# EAGLE design cartridge (EAGLE 7.1.0)
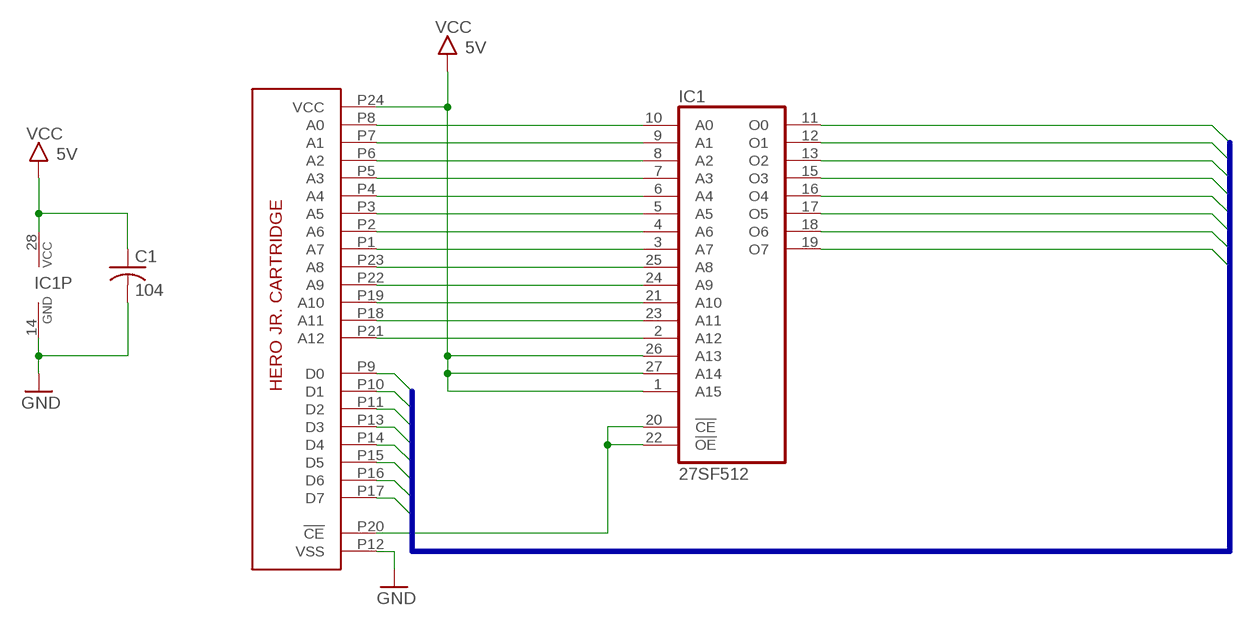
[diagram p0: schematic, sheet 1]

## Parts
C1  104  C-US050-024X044  [C050-024X044]
IC1  27SF512  27512  [DIL28]
U$1  HEROJRCART  [HEROJRCART]

## Nets
D0: IC1.11(O0) U$1.P9(D0)
D1: IC1.12(O1) U$1.P10(D1)
D2: IC1.13(O2) U$1.P11(D2)
D3: IC1.15(O3) U$1.P13(D3)
D4: IC1.16(O4) U$1.P14(D4)
D5: IC1.17(O5) U$1.P15(D5)
D6: IC1.18(O6) U$1.P16(D6)
D7: IC1.19(O7) U$1.P17(D7)
GND: C1.2 IC1.14(GND) U$1.P12(VSS)
N$1: IC1.20(!CE) IC1.22(!OE) U$1.P20(!CE)
N$2: IC1.10(A0) U$1.P8(A0)
N$4: IC1.9(A1) U$1.P7(A1)
N$5: IC1.8(A2) U$1.P6(A2)
N$6: IC1.7(A3) U$1.P5(A3)
N$7: IC1.6(A4) U$1.P4(A4)
N$8: IC1.5(A5) U$1.P3(A5)
N$9: IC1.4(A6) U$1.P2(A6)
N$10: IC1.3(A7) U$1.P1(A7)
N$11: IC1.25(A8) U$1.P23(A8)
N$12: IC1.24(A9) U$1.P22(A9)
N$13: IC1.21(A10) U$1.P19(A10)
N$14: IC1.23(A11) U$1.P18(A11)
N$15: IC1.2(A12) U$1.P21(A12)
VCC: C1.1 IC1.1(A15) IC1.26(A13) IC1.27(A14) IC1.28(VCC) U$1.P24(VCC) ; supply symbol labelled 5V

## Buses
B$1

## Library data of the parts
C1 = rcl:C-US: CAPACITOR, American symbol
IC1 = memory:27512: MEMORY
U$1 = bt:HEROJRCART: Hero Jr. Cartridge (ROM)

## Board
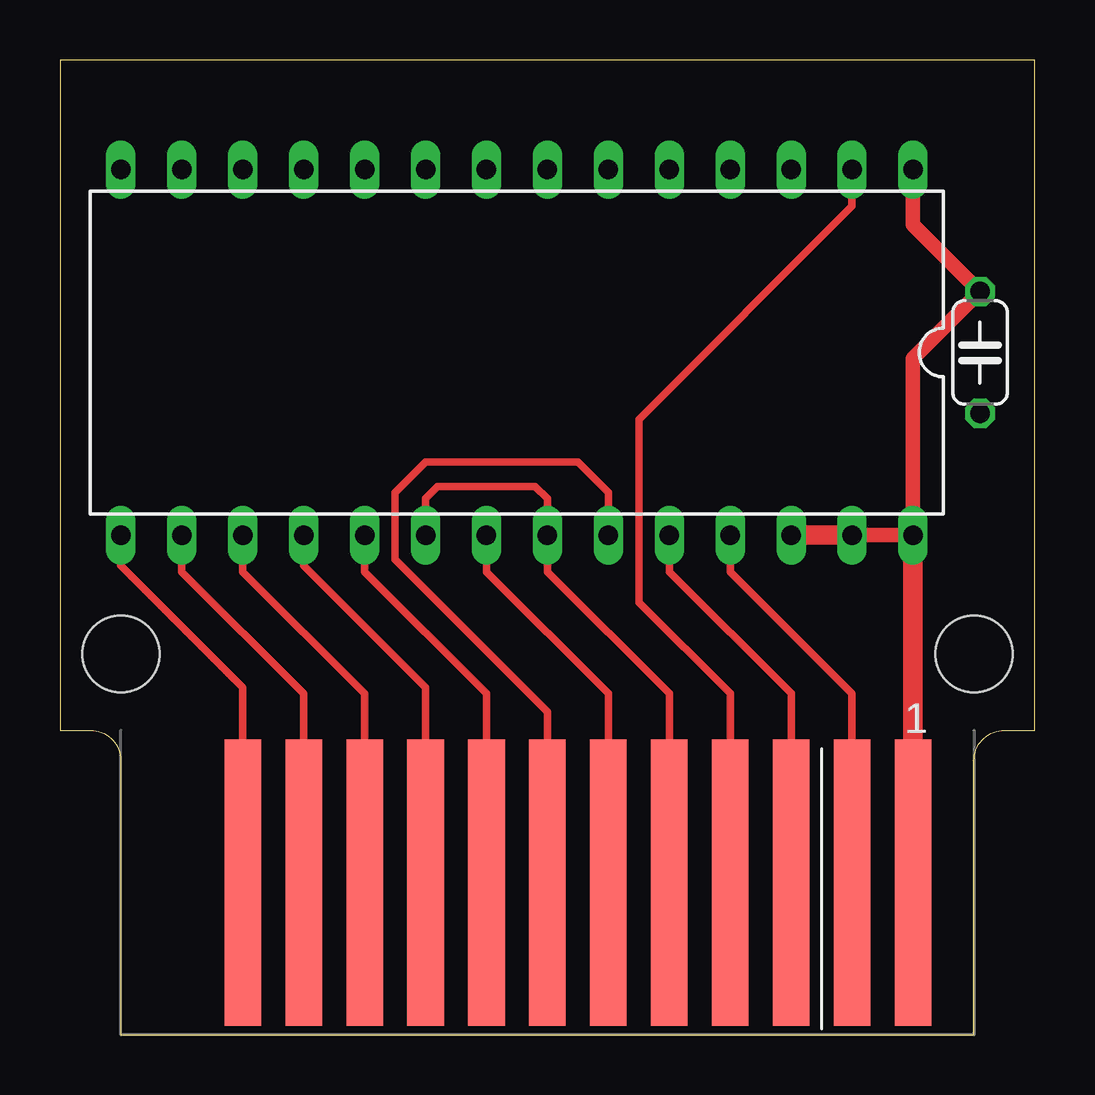
[diagram p1: board, top side]
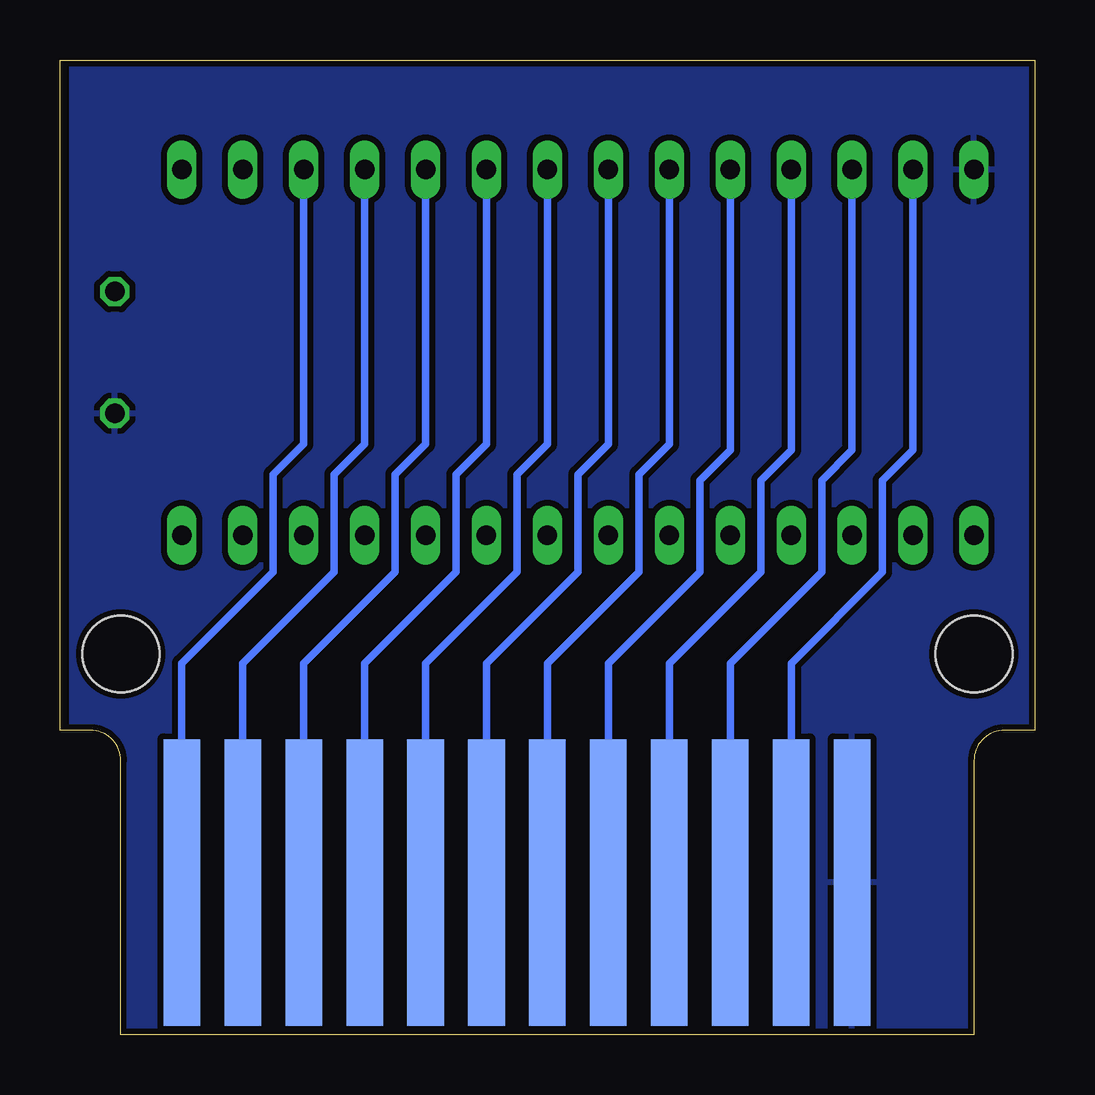
[diagram p2: board, bottom side, seen from below]

Size 40.64 x 40.64 mm. Coordinates in mm from the lower left corner, seen from the top.
Outline: 2.54,0 38.1,0 38.1,11.43 arc-90 39.37,12.7 40.64,12.7 40.64,40.64 0,40.64 0,12.7 1.27,12.7 arc-90 2.54,11.43 2.54,0
Copper layers (1*16): Top 0.0356mm / dielectric 1.5011mm / Bottom 0.0356mm
Design rules "LaenPCBOrder": minimum track width 6mil, minimum drill 13mil, track to track 10mil, track to pad 10mil, pad to pad 10mil, via to via 10mil, smd to smd 8mil, copper to edge 10mil, drill to drill 10mil, minimum pad ring 7mil, minimum via ring 7mil, stop-mask expansion 3mil, vias tented up to drill 20mil, thermal gap 10mil
Holes 3.2 mm at 2.54,15.88 38.1,15.88

### Footprints (pad centres in the part's own frame; a part is rotated, then mirrored left to right if it is on the bottom)
C050-024X044 = drill 0.813 octagon: 1 -2.54,0; 2 2.54,0
DIL28 = drill 0.813 long: 1 -16.51,-7.62; 2 -13.97,-7.62; 3 -11.43,-7.62; 4 -8.89,-7.62; 5 -6.35,-7.62; 6 -3.81,-7.62; 7 -1.27,-7.62; 8 1.27,-7.62; 9 3.81,-7.62; 10 6.35,-7.62; 11 8.89,-7.62; 12 11.43,-7.62; 13 13.97,-7.62; 14 16.51,-7.62; 15 16.51,7.62; 16 13.97,7.62; 17 11.43,7.62; 18 8.89,7.62; 19 6.35,7.62; 20 3.81,7.62; 21 1.27,7.62; 22 -1.27,7.62; 23 -3.81,7.62; 24 -6.35,7.62; 25 -8.89,7.62; 26 -11.43,7.62; 27 -13.97,7.62; 28 -16.51,7.62
HEROJRCART = smd 1.524 x 11.938 bottom: P1 15.24,0.254; P2 12.7,0.254; P3 10.16,0.254; P4 7.62,0.254; P5 5.08,0.254; P6 2.54,0.254; P7 0,0.254; P8 -2.54,0.254; P9 -5.08,0.254; P10 -7.62,0.254; P11 -10.16,0.254; P12 -12.7,0.254 | smd 1.524 x 11.938: P13 -12.7,0.254; P14 -10.16,0.254; P15 -7.62,0.254; P16 -5.08,0.254; P17 -2.54,0.254; P18 0,0.254; P19 2.54,0.254; P20 5.08,0.254; P21 7.62,0.254; P22 10.16,0.254; P23 12.7,0.254; P24 15.24,0.254

### Placement (x,y rotation side)
C1  38.35,28.45 270 top
IC1  19.05,28.45 180 top
U$1  20.32,6.1 0 top

### Tracks (layer width: path | path; a pad name or v marks a point on that pad's centre or on a via)
D0
  Bottom 0.305: IC1.11 10.16,24.38 11.43,23.11 11.43,19.3 15.24,15.49 U$1.P9
D1
  Bottom 0.305: IC1.12 7.62,24.38 8.89,23.11 8.89,19.3 12.7,15.49 U$1.P10
D2
  Bottom 0.305: IC1.13 5.08,24.38 6.35,23.11 6.35,19.3 10.16,15.49 U$1.P11
D3
  Top 0.305: IC1.15 2.54,19.56 7.62,14.48 U$1.P13
D4
  Top 0.305: IC1.16 5.08,19.3 10.16,14.22 U$1.P14
D5
  Top 0.305: IC1.17 7.62,19.3 12.7,14.22 U$1.P15
D6
  Top 0.305: IC1.18 10.16,19.56 15.24,14.48 U$1.P16
D7
  Top 0.305: IC1.19 12.7,19.3 17.78,14.22 U$1.P17
GND
  pour Bottom: 0,40.89 0,0 40.13,0 40.13,40.89
N$1
  Top 0.305: U$1.P20 25.4,14.22 20.32,19.3 IC1.22 20.32,22.35 19.81,22.86 15.75,22.86 15.24,22.35 IC1.20
N$2
  Bottom 0.305: U$1.P8 17.78,15.49 13.97,19.3 13.97,23.11 12.7,24.38 IC1.10
N$4
  Bottom 0.305: U$1.P7 20.32,15.49 16.51,19.3 16.51,23.37 15.24,24.64 IC1.9
N$5
  Bottom 0.305: IC1.8 17.78,24.64 19.05,23.37 19.05,19.3 22.86,15.49 U$1.P6
N$6
  Bottom 0.305: U$1.P5 25.4,15.49 21.59,19.3 21.59,23.37 20.32,24.64 IC1.7
N$7
  Bottom 0.305: IC1.6 22.86,24.64 24.13,23.37 24.13,19.3 27.94,15.49 U$1.P4
N$8
  Bottom 0.305: U$1.P3 30.48,15.49 26.67,19.3 26.67,23.37 25.4,24.64 IC1.5
N$9
  Bottom 0.305: U$1.P2 33.02,15.49 29.21,19.3 29.21,23.37 27.94,24.64 IC1.4
N$10
  Bottom 0.305: U$1.P1 35.56,15.49 31.75,19.3 31.75,23.37 30.48,24.64 IC1.3
N$11
  Top 0.305: U$1.P23 33.02,14.22 27.94,19.3 IC1.25
N$12
  Top 0.305: U$1.P22 30.48,14.22 25.4,19.3 IC1.24
N$13
  Top 0.305: U$1.P19 22.86,14.22 17.78,19.3 IC1.21
N$14
  Top 0.305: U$1.P18 20.32,13.46 13.97,19.81 13.97,22.61 15.24,23.88 21.59,23.88 22.86,22.61 IC1.23
N$15
  Top 0.305: U$1.P21 27.94,14.22 24.13,18.03 24.13,25.65 33.02,34.54 IC1.2
VCC
  Top 0.61: IC1.27 IC1.28 35.56,28.19 C1.1 35.56,33.78 IC1.1
  Top 0.813: IC1.27 IC1.26 | U$1.P24 IC1.28